# Altium schematic sheet lab2_yakimenko_boost.SchDoc: =title_line_1 + title_line_2
size 420 x 297 mm; SheetNumber: n
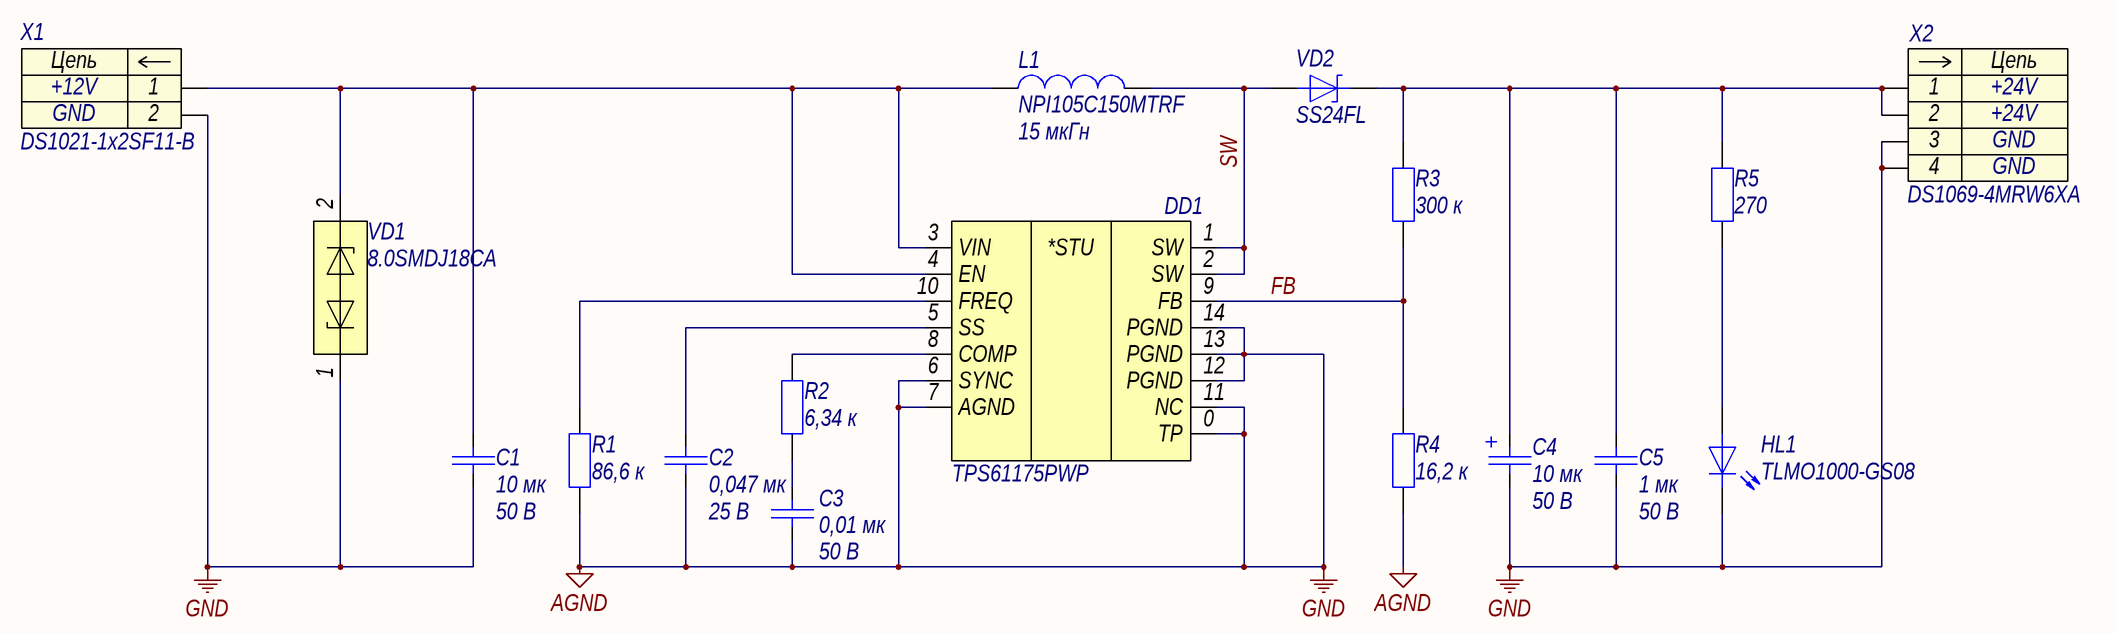
[diagram p0: lab2_yakimenko_boost.SchDoc]

## Parts
C1  10 мк  Напряжение: 50 В  [C0805]
C2  0,047 мк  Напряжение: 25 В  [C0603]
C3  0,01 мк  Напряжение: 50 В  [C0603]
C4  10 мк  Напряжение: 50 В  [SVPF10M]
C5  1 мк  Напряжение: 50 В  [C0603]
DD1  TPS61175PWP  [HTSSOP-14]
HL1  TLMO1000-GS08  [HL0603]
L1  NPI105C150MTRF  Индуктивность: 15 мкГн  [NPI-2-1000X900X540]
R1  86,6 к  [R0603]
R2  6,34 к  [R0603]
R3  300 к  [R0603]
R4  16,2 к  [R0603]
R5  270  [R0603]
VD1  8.0SMDJ18CA  [DO-214AB]
VD2  SS24FL  [SOD123]
X1  DS1021-1x2SF11-B  [DS1021-1X2SF11-B]
X2  DS1069-4MRW6XA  [HDR1X4]

## Nets
AGND: C1.2 C2.2 C3.2 C4.2 C5.2 DD1.0(TP) DD1.6(SYNC) DD1.7(AGND) DD1.11(NC) DD1.12(PGND) DD1.13(PGND) DD1.14(PGND) HL1.1 R1.1 R4.1 VD1.1 X1.2 X2.3 X2.4  [also labelled GND]
FB: DD1.9(FB) R3.1 R4.2
SW: DD1.1(SW) DD1.2(SW) L1.2 VD2.2
NetC1_1: C1.1 DD1.3(VIN) DD1.4(EN) L1.1 VD1.2 X1.1
NetC2_1: C2.1 DD1.5(SS)
NetC3_1: C3.1 R2.1
NetC4_1: C4.1 C5.1 R3.2 R5.2 VD2.1 X2.1 X2.2
NetDD1_8: DD1.8(COMP) R2.2
NetDD1_10: DD1.10(FREQ) R1.2
NetHL1_2: HL1.2 R5.1

## Notes on the sheet
- Перв. примен.
- Справ. №
- Подп. и дата
- Инв. № дубл.
- Нормоконтроль:
- Взам. инв. №
- Изм.
- Лист
- № докум.
- Подп.
- Дата
- Лит.
- Масса
- Масштаб
- Т.контр.
- Пров.
- Разраб.
- Листов
- Разработал:
- Инв. № подл.
- Н.контр.
- Утв.
- Копировал
- Формат
- А3
- (in symbol dd0018) *STU
- (in symbol x0009) Цепь
- (in symbol x0020) Цепь

## Library data of the parts
C1 = c0091: =Описание; ID: c0091; Фамилия: Паньков; Описание: Конденсатор чип 0805 10 мкФ 50 В ±10 %; Наименование: CC0805KRX5R9BB106; Производитель: YAGEO Corp.; Отклонение: ±10 %; Рабочие температуры: от –55 °С до +85 °С; Температурный коэффициент емкости: X5R; Корпус: 0805; Номинал: 10 мк; Номинальное напряжение: 50 В; HelpURL: https://www.yageo.com/upload/media/product/productsearch/datasheet/mlcc/UPY-GPHC_X5R_4V-to-50V_26.pdf
C2 = c0025: =Описание; ID: c0025; Фамилия: Якименко; Описание: Конденсатор чип 0603 33 нФ 16 В ±5 %; Наименование: C0805C473J3GACTU; Производитель: Kemet; Отклонение: ±5 %; Рабочие температуры: от –55 °С до +125 °С; Корпус: 0805; Номинал: 0,047 мк; Номинальное напряжение: 25 В; HelpURL: https://www.kemet.com/docfinder.html?Partnumber=C0805C473J3GACTU
C3 = c0021: =Описание; ID: c0021; Фамилия: Якименко; Описание: Конденсатор чип 0603 10 нФ 100 В ±5 %; Наименование: CGA4C2C0G1H103J060AA; Производитель: TDK; Отклонение: ±5 %; Рабочие температуры: от –55 °С до +125 °С; Корпус: 0805; Номинал: 0,01 мк; Номинальное напряжение: 50 В; HelpURL: https://product.tdk.com/en/search/capacitor/ceramic/mlcc/info?part_no=CGA4C2C0G1H103J060AA
C4 = c0114: =Описание; ID: c0114; Фамилия: Якименко; Наименование: 50SVPF10M; Производитель: Panasonic; Отклонение: ±10 %; Рабочие температуры: от –55 °С до +125 °С; Корпус: 6.6 x 6.6 x 5.8; Номинал: 10 мк; Номинальное напряжение: 50 В; Температурный коэффициент емкости: -; HelpURL: https://industrial.panasonic.com/content/data/CP/PDF/OS-CON/S_OS-CON_SVPF_e.pdf
C5 = c0061: =Описание; ID: c0061; Фамилия: Самарин; Описание: Конденсатор чип 0603 1 мкФ 50 В ±10 %; Наименование: CC0603KPX5R9BB105; Производитель: YAGEO Corp.; Отклонение: ±10 %; Рабочие температуры: от –55 °С до +85 °С; Температурный коэффициент емкости: X5R; Корпус: 0603; Номинал: 1 мк; Номинальное напряжение: 50 В; HelpURL: https://www.yageo.com/upload/media/product/productsearch/datasheet/mlcc/UPY-GPHC_X5R_4V-to-50V_26.pdf
DD1 = dd0018: =Описание; ID: dd0018; Фамилия: Якименко; Описание: Повышающий преобразователь напряжения 38 В и 3,8 А; Производитель: Texas Instruments; Входное напряжение: от 2,9 В до 18 В; Выходное напряжение: от 2,9 В до 38 В; Коммутируемый ток: до 3,8 А; Частота переключения: от 160 кГц до 2,64 МГц; Рабочие температуры: от -40 °С до +85 °С; Наименование: TPS61175PWP; Корпус: HTSSOP-14; HelpURL: https://www.ti.com/product/TPS61175
HL1 = hl0002: =Описание; ID: hl0002; Фамилия: Ларионов; Описание: Светодиод чип 0603 светло-оранжевый; Производитель: Vishay Intertechnology, Inc.; Цвет: Soft orange; Номинальная сила света: 7,5 мкд; Номинальная длина волны: 605 нм; Номинальный прямой ток: 15 мА; Номинальное падение напряжения: 1,8 В; Рассеиваемая мощность: 40 мВт; Рабочие температуры: от –40 °С до +100 °С; Корпус: 0603; Наименование: TLMO1000-GS08; HelpURL: https://www.vishay.com/leds/list/product-83172/
L1 = l0014: =Описание; ID: l0014; Фамилия: Якименко; Описание: Катушка индуктивности 15 мкГн ±20 %; Производитель: NIC Components Corp.; Отклонение: ±20 %; Номинальное активное сопротивление: 80 мОм; Резонансная частота: не указано; Номинальный ток (при нагреве на 20 °С/40 °С): 1,5 А; Ток насыщения: 2,27 А; Рабочие температуры: от –40 °С до +85 °С; Корпус: 10,0 x 9,0 x 5,4; Наименование: NPI105C150MTRF; Номинал: 15 мкГн; Максимальное активное сопротивление: 80 мОм; Рабочее напряжение: не указано; HelpURL: https://www.niccomp.com/quickBUILDER/QBPN.php?pNumber=NPI105C150MTRF
R1 = r0091: =Описание; ID: r0091; Фамилия: Якименко; Описание: Резистор чип 0603 82 кОм ±1 % 0,1 Вт; Наименование: RC0201FR-0786K6L; Производитель: YAGEO Corp.; Номинал: 82 к; Отклонение: ±1 %; Номинальное напряжение: 25 В; Рабочие температуры: от –55 °С до +155 °С; HelpURL: https://www.yageo.com/en/Home
R2 = r0054: =Описание; ID: r0054; Фамилия: Якименко; Наименование: CRCW04026K34FKED; Производитель: Vishay-Dale; Номинал: 6,2 к; Отклонение: ±1 %; Номинальное напряжение: 50 В; Рабочие температуры: от –55 °С до +155 °С; HelpURL: https://www.vishay.com/docs/20035/dcrcwe3.pdf
R3 = r0112: =Описание; ID: r0112; Фамилия: Паньков; Описание: Резистор чип 0603 300 кОм ±1 % 0,1 Вт; Наименование: RC0603FR-07300KL; Производитель: YAGEO Corp.; Отклонение: ±1 %; Номинальное напряжение: 75 В; Рабочие температуры: от –55 °С до +155 °С; Номинальный ток: 1 А; Корпус: 0603; Примечание: Ряд E24; Номинал: 300 к; HelpURL: https://www.yageo.com/upload/media/product/productsearch/datasheet/rchip/PYu-RC_Group_51_RoHS_L_11.pdf
R4 = r0067: =Описание; ID: r0067; Фамилия: Якименко; Описание: м ±1 % 0,1 Вт; Наименование: CRCW040216K2FKED; Производитель: VISHAY; Номинал: 16 к; Отклонение: ±1 %; Номинальное напряжение: 50 В; Рабочие температуры: от –55 °С до +155 °С; Номинальный ток: 1 А; HelpURL: https://www.vishay.com/docs/20035/dcrcwe3.pdf
R5 = r0017: =Описание; ID: r0017; Фамилия: Паньков; Описание: Резистор чип 0603 270 Ом ±1 % 0,1 Вт; Наименование: RC0603FR-07270RL; Производитель: YAGEO Corp.; Отклонение: ±1 %; Номинальное напряжение: 75 В; Рабочие температуры: от –55 °С до +155 °С; Номинальный ток: 1 А; Корпус: 0603; Примечание: Ряд E24; Номинал: 270; HelpURL: https://www.yageo.com/upload/media/product/productsearch/datasheet/rchip/PYu-RC_Group_51_RoHS_L_11.pdf
VD1 = vd0004: =Описание; ID: vd0004; Фамилия: Шкабара; Описание: Двунаправленная диодная сборка для подавления помех, 14 В; Производитель: Littelfuse, Inc.; Наименование: 8.0SMDJ18CA; Корпус: DO-214AB; HelpURL: https://www.littelfuse.com/products/tvs-diodes/surface-mount/8.0smdj.aspx
VD2 = vd0001: =Описание; ID: vd0001; Фамилия: Якименко; Описание: Диод Шотки; Производитель: Fairchild Semiconductor; Пиковое прямое напряжение: 0,55 В; Импульсное обратное напряжение: 40 В; Макс допустимый средний прямой ток: 2 А; Рабочие температуры: от –65 °С до +125 °С; Корпус: SOD123F; Наименование: SS24FL; HelpURL: https://www.onsemi.com/
X1 = x0009: =Описание; Contact_1: +12V; Contact_2: GND; ID: x0009; Фамилия: Паньков; Описание: PLS 2 pin 2,54 мм вилка прямой; Производитель: Connfly Electronic Co. LTD.; Наименование: DS1021-1x2SF11-B; HelpURL: http://en.connfly.group/product/xVkr=EusQssAN0gN=Aos=mU+UrVkR9kqEAN0gN9g+WqANB+A
X2 = x0020: =Описание; Contact_1: +24V; Contact_3: GND; ID: x0020; Фамилия: Паньков; Описание: CWF 4 pin Type A 2,5 мм вилка угловой; Производитель: Connfly Electronic Co. LTD.; Contact_2: +24V; Contact_4: GND; Наименование: DS1069-4MRW6XA; HelpURL: http://en.connfly.group/product/xVkr=EusQssAN0gN=Aos=mU+UrVkR9kqEAN0gN0MUR+g+NB+A